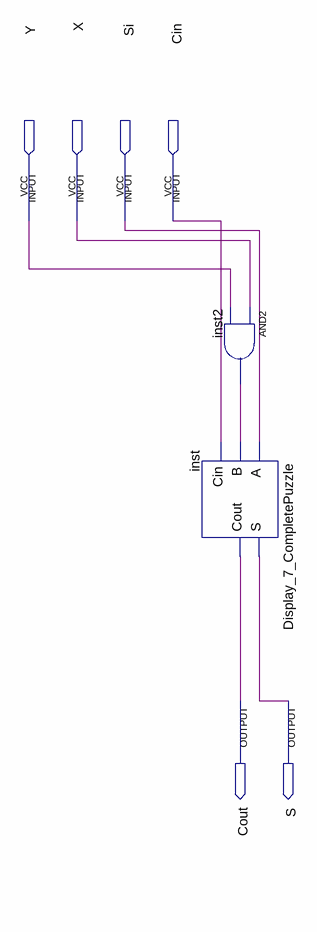
[diagram p0: schematic sheet]
// Quartus schematic Unidade_multiplicadora.bdf as structural Verilog: 2 symbols, 6 pins
module Unidade_multiplicadora (
  input  Y,
  input  X,
  input  Si,
  input  Cin,
  output Cout,
  output S
);

  wire inst2_out;

  Display_7_CompletePuzzle inst (.A(Si), .B(inst2_out), .Cin(Cin), .S(S), .Cout(Cout));
  and inst2 (inst2_out, X, Y);
endmodule
